# Altium project USB_HUB.PrjPcb
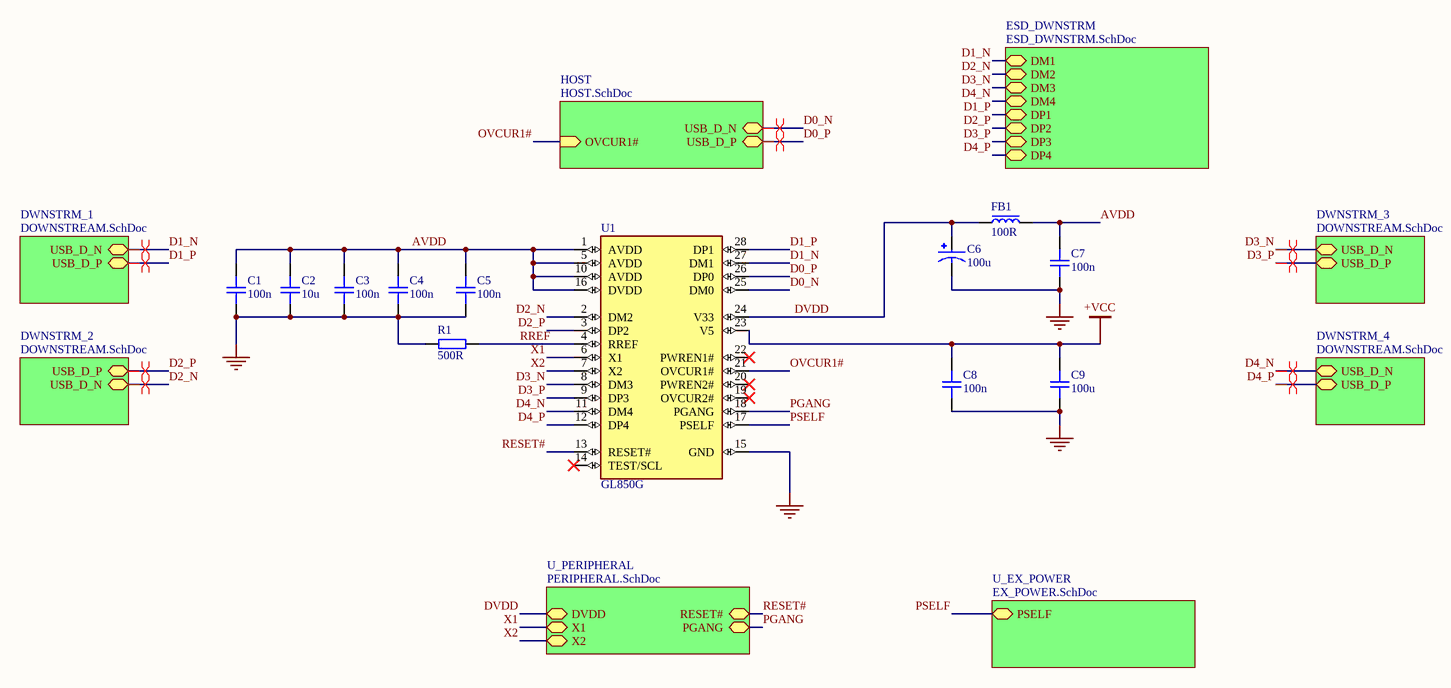
[diagram p0: MAIN.SchDoc]
5 sheets, 51 parts. Net scope: hierarchical (ports join the sheet entries above them; power ports are global).
Board file: USB_HUB.PcbDoc
Sheets:
  MAIN.SchDoc
    DWNSTRM_1 = DOWNSTREAM.SchDoc
    DWNSTRM_2 = DOWNSTREAM.SchDoc
    DWNSTRM_3 = DOWNSTREAM.SchDoc
    DWNSTRM_4 = DOWNSTREAM.SchDoc
    ESD_DWNSTRM = ESD_DWNSTRM.SchDoc
    U_PERIPHERAL = PERIPHERAL.SchDoc
    U_EX_POWER = EX_POWER.SchDoc

## Sheet MAIN.SchDoc
size A3; SheetNumber: 1; SheetTotal: 6

### Parts
C1  100n  [CAP_0805]
C2  10u  [CAP_0805]
C3  100n  [CAP_0805]
C4  100n  [CAP_0805]
C5  100n  [CAP_0805]
C6  100u  [CAP_EEEHA0J101WR]
C7  100n  [CAP_0805]
C8  100n  [CAP_0805]
C9  100u  [CAP_0805]
FB1  100R  [FB_0603]
R1  500R  [RES_0603]
U1  GL850G  [SSOP28]

### Sub-sheets
DWNSTRM_1 = DOWNSTREAM.SchDoc: USB_D_N (bidir), USB_D_P (bidir)
DWNSTRM_2 = DOWNSTREAM.SchDoc: USB_D_N (bidir), USB_D_P (bidir)
DWNSTRM_3 = DOWNSTREAM.SchDoc: USB_D_N (bidir), USB_D_P (bidir)
DWNSTRM_4 = DOWNSTREAM.SchDoc: USB_D_N (bidir), USB_D_P (bidir)
ESD_DWNSTRM = ESD_DWNSTRM.SchDoc: DM1 (bidir), DM2 (bidir), DM3 (bidir), DM4 (bidir), DP1 (bidir), DP2 (bidir), DP3 (bidir), DP4 (bidir)
HOST = HOST.SchDoc (file not in this document): USB_D_N (bidir), USB_D_P (bidir), OVCUR1# (in)
U_EX_POWER = EX_POWER.SchDoc: PSELF (bidir)
U_PERIPHERAL = PERIPHERAL.SchDoc: RESET# (bidir), PGANG (bidir), DVDD (bidir), X1 (bidir), X2 (bidir)

### Nets
+VCC: C8.2 C9.2 U1.23(V5)
GND: C1.1 C2.1 C3.2 C4.1 C5.1 C6.2 C7.1 C8.1 C9.1 R1.1 U1.15(GND)
AVDD: C1.2 C2.2 C3.1 C4.2 C5.2 C7.2 FB1.2 U1.1(AVDD) U1.5(AVDD) U1.10(AVDD) U1.16(DVDD)
D0_N: U1.25(DM0) ; sheet HOST/USB_D_N
D0_P: U1.26(DP0) ; sheet HOST/USB_D_P
D1_N: U1.27(DM1) ; sheet DWNSTRM_1/USB_D_N, sheet ESD_DWNSTRM/DM1
D1_P: U1.28(DP1) ; sheet DWNSTRM_1/USB_D_P, sheet ESD_DWNSTRM/DP1
D2_N: U1.2(DM2) ; sheet DWNSTRM_2/USB_D_N, sheet ESD_DWNSTRM/DM2
D2_P: U1.3(DP2) ; sheet DWNSTRM_2/USB_D_P, sheet ESD_DWNSTRM/DP2
D3_N: U1.8(DM3) ; sheet DWNSTRM_3/USB_D_N, sheet ESD_DWNSTRM/DM3
D3_P: U1.9(DP3) ; sheet DWNSTRM_3/USB_D_P, sheet ESD_DWNSTRM/DP3
D4_N: U1.11(DM4) ; sheet DWNSTRM_4/USB_D_N, sheet ESD_DWNSTRM/DM4
D4_P: U1.12(DP4) ; sheet DWNSTRM_4/USB_D_P, sheet ESD_DWNSTRM/DP4
DVDD: C6.1 FB1.1 U1.24(V33) ; sheet U_PERIPHERAL/DVDD
OVCUR1#: U1.21(OVCUR1#) ; sheet HOST/OVCUR1#
PGANG: U1.18(PGANG) ; sheet U_PERIPHERAL/PGANG
PSELF: U1.17(PSELF) ; sheet U_EX_POWER/PSELF
RESET#: U1.13(RESET#) ; sheet U_PERIPHERAL/RESET#
RREF: R1.2 U1.4(RREF)
X1: U1.6(X1) ; sheet U_PERIPHERAL/X1
X2: U1.7(X2) ; sheet U_PERIPHERAL/X2

Not connected (* = marked no-connect by the designer): U1 14(TEST/SCL)* 19(OVCUR2#)* 20(PWREN2#)* 22(PWREN1#)*

### Layout directives
differential pair: D0_N, D0_P, D1_N, D1_P, D2_N, D2_P, D3_N, D3_P, D4_N, D4_P

### Library data of the parts
C1-C5 C7-C9 = CAP_0805: Capacitor SMD 0805; Manufacturer: *; Manufacturer Part Number: *; Distributor Link: *; LCSC: *; Rating: *; Dielectric: *
C6 = EEEHA0J101WR: CAPACITOR ALUM ELEC, 100UF, 20%, 6.3V, S; CAPACITOR ALUM ELEC, 100UF, 20%, 6.3V, SMD; Product Range:PANASONIC - HA Series; Capacitance:100ÂµF; Capacitance Tolerance:Â± 20%; Voltage Rating:6.3V; Capacitor Case Style:Radial Can - SMD; Diameter:5mm; Height:5.4mm; Series:HA; MF: Panasonic Electronic; MP: EEE-HA0J101WR; Availability: In Stock; Check_prices: https://www.snapeda.com/parts/EEE-HA0J101WR/Panasonic%20Electronic%20Components/view-part/2733110/?ref=eda; SnapEDA_Link: https://www.snapeda.com/parts/EEE-HA0J101WR/Panasonic%20Electronic%20Components/view-part/2733110/?ref=snap; Purchase-URL: https://pricing.snapeda.com/search/part/EEE-HA0J101WR/?ref=eda; Package: RADIAL-2 Panasonic; Value: *; Price: None
FB1 = FB_0603: Ferrite Bead SMD 0603; Manufacturer: *; Manufacturer Part Number: *; Distributor Link: *; LCSC: *
R1 = RES_0603: Resistor SMD 0603; Manufacturer: *; Manufacturer Part Number: *; Distributor Link: *; LCSC: *
U1 = GL850G: Programmable Logic IC Development Tools; Manufacturer: Vishay Intertechnology; SnapEDA_Link: https://www.snapeda.com/parts/GL850G/Vishay/view-part/?ref=snap; Availability: Not in stock; Check_prices: https://www.snapeda.com/parts/GL850G/Vishay/view-part/?ref=eda; Manufacturer Part Number: GL850G; Package: None; Price: None

## Sheet DOWNSTREAM.SchDoc
size A4; SheetNumber: 3; SheetTotal: 6
Used 4 times, as channels DWNSTRM_1, DWNSTRM_2, DWNSTRM_3, DWNSTRM_4. Parts and nets are listed once, with the designators drawn on the sheet.
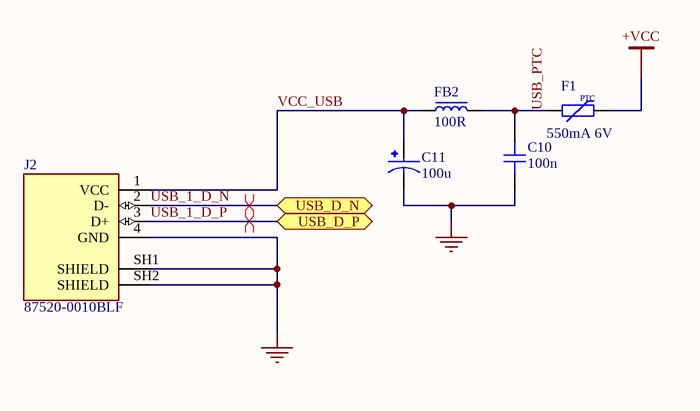
[diagram p1: DOWNSTREAM.SchDoc]

### Parts
C10  100n  [CAP_0805]
C11  100u  [CAP_EEEHA0J101WR]
F1  550mA 6V  [FUSE_1206]
FB2  100R  [FB_0603]
J2  87520-0010BLF  [AMPHENOL_87520-0010BLF]

### Ports
USB_D_N (bidir), USB_D_P (bidir)

### Nets
+VCC: F1.2
GND: C10.1 C11.2 J2.4(GND) J2.SH1(SHIELD) J2.SH2(SHIELD)
USB_1_D_N: J2.2(D-) ; port USB_D_N
USB_1_D_P: J2.3(D+) ; port USB_D_P
USB_PTC: C10.2 F1.1 FB2.2
VCC_USB: C11.1 FB2.1 J2.1(VCC)

### Channels
DWNSTRM_1: designators end in A; ports USB_D_N=D1_N USB_D_P=D1_P
DWNSTRM_2: designators end in B; ports USB_D_N=D2_N USB_D_P=D2_P
DWNSTRM_3: designators end in C; ports USB_D_N=D3_N USB_D_P=D3_P
DWNSTRM_4: designators end in D; ports USB_D_N=D4_N USB_D_P=D4_P

### Layout directives
differential pair: D1_N, D1_P

### Notes on the sheet
- (in symbol FUSE_PPTC_1206) PTC

### Library data of the parts
C10 = CAP_0805: Capacitor SMD 0805; Manufacturer: *; Manufacturer Part Number: *; Distributor Link: *; LCSC: *; Rating: *; Dielectric: *
C11 = EEEHA0J101WR: as C6 on sheet MAIN; Availability: In Stock; Check_prices: https://www.snapeda.com/parts/EEE-HA0J101WR/Panasonic%20Electronic%20Components/view-part/2733110/?ref=eda; SnapEDA_Link: https://www.snapeda.com/parts/EEE-HA0J101WR/Panasonic%20Electronic%20Components/view-part/2733110/?ref=snap; Purchase-URL: https://pricing.snapeda.com/search/part/EEE-HA0J101WR/?ref=eda; Package: RADIAL-2 Panasonic; Value: *; Price: None
F1 = FUSE_PPTC_1206: Fuse PPTC SMD 1206; Manufacturer: *; Manufacturer Part Number: *
FB2 = FB_0603: Ferrite Bead SMD 0603; Manufacturer: *; Manufacturer Part Number: *; Distributor Link: *; LCSC: *
J2 = 87520-0010BLF: Conn Data USB TypeA Socket 4Cnts RightAngle ThruHole White 1.57mmPCB | Amphenol FCI (Amphenol CS) 87520-0010BLF; MF: AMPHENOL ICC / FCI; SnapEDA_Link: https://www.snapeda.com/parts/87520-0010BLF/Amphenol/view-part/?ref=snap; Package: None; Value: *; MP: 87520-0010BLF; Check_prices: https://www.snapeda.com/parts/87520-0010BLF/Amphenol/view-part/?ref=eda

## Sheet ESD_DWNSTRM.SchDoc
size A4; SheetNumber: 4; SheetTotal: 6
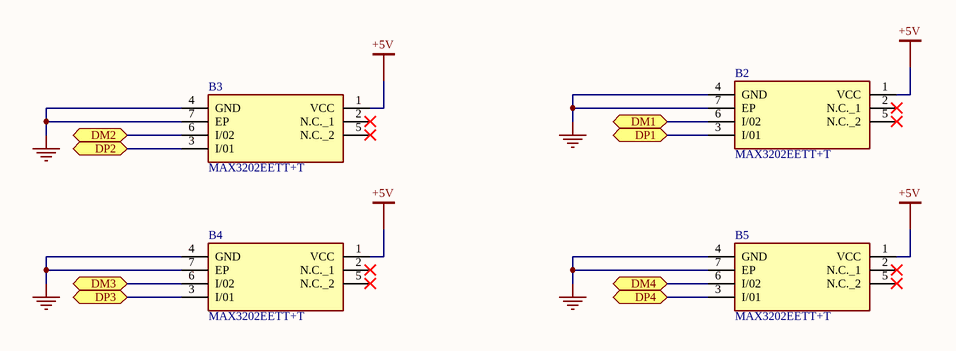
[diagram p2: ESD_DWNSTRM.SchDoc]

### Parts
B2  MAX3202EETT+T  [SON95P300X300X80-7N]
B3  MAX3202EETT+T  [SON95P300X300X80-7N]
B4  MAX3202EETT+T  [SON95P300X300X80-7N]
B5  MAX3202EETT+T  [SON95P300X300X80-7N]

### Ports
DM1 (bidir), DM2 (bidir), DM3 (bidir), DM4 (bidir), DP1 (bidir), DP2 (bidir), DP3 (bidir), DP4 (bidir)

### Nets
+5V: B2.1(VCC) B3.1(VCC) B4.1(VCC) B5.1(VCC)
GND: B2.4(GND) B2.7(EP) B3.4(GND) B3.7(EP) B4.4(GND) B4.7(EP) B5.4(GND) B5.7(EP)
D1_N: B2.6(I/02) ; port DM1
D1_P: B2.3(I/01) ; port DP1
D2_N: B3.6(I/02) ; port DM2
D2_P: B3.3(I/01) ; port DP2
D3_N: B4.6(I/02) ; port DM3
D3_P: B4.3(I/01) ; port DP3
D4_N: B5.6(I/02) ; port DM4
D4_P: B5.3(I/01) ; port DP4

Not connected (* = marked no-connect by the designer): B2 2(N.C._1)* 5(N.C._2)*; B3 2(N.C._1)* 5(N.C._2)*; B4 2(N.C._1)* 5(N.C._2)*; B5 2(N.C._1)* 5(N.C._2)*

### Library data of the parts
B2-B5 = MAX3202EETT+T: ESD Suppressors / TVS Diodes Low-Capacitance, 2/3/4/6-Channel, 15kV ESD-Protection Arrays for High-Speed Data Interfaces; Manufacturer_Name: Analog Devices; Geometry.Height: 0.8mm; Mouser Part Number: 700-MAX3202EETTT; Mouser Price/Stock: https://www.mouser.co.uk/ProductDetail/Analog-Devices-Maxim-Integrated/MAX3202EETT%2bT?qs=8wHch9UpSvZOsR663CaSvw%3D%3D; Manufacturer_Part_Number: MAX3202EETT+T; Datasheet Link: https://pdfserv.maximintegrated.com/en/ds/MAX3202E-MAX3206E.pdf

## Sheet PERIPHERAL.SchDoc
size A4; SheetNumber: 5; SheetTotal: 6
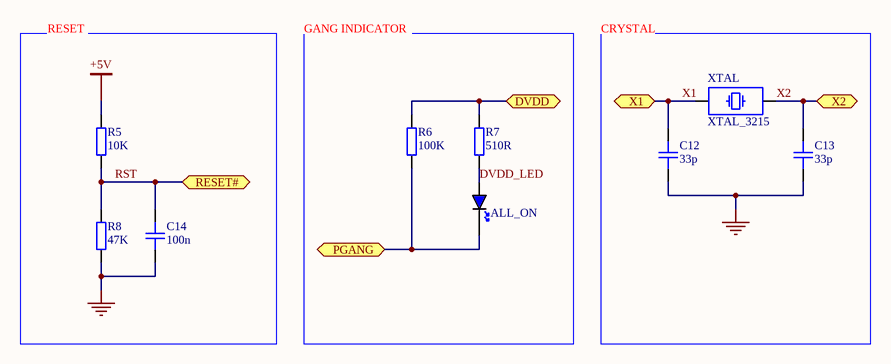
[diagram p3: PERIPHERAL.SchDoc]

### Parts
ALL_ON  BLUE  [LED_0603_BLUE]  (value not drawn)
C12  33p  [CAP_0402]
C13  33p  [CAP_0402]
C14  100n  [CAP_0805]
R5  10K  [RES_0805]
R6  100K  [RES_0603]
R7  510R  [RES_0603]
R8  47K  [RES_0603]
XTAL  XTAL_3215  [XTAL_3215-2]

### Ports
DVDD (bidir), PGANG (bidir), RESET# (bidir), X1 (bidir), X2 (bidir)

### Nets
+5V: R5.2
GND: C12.1 C13.1 C14.1 R8.1
DVDD: R6.2 R7.2 ; port DVDD
DVDD_LED: ALL_ON.A R7.1
PGANG: ALL_ON.K R6.1 ; port PGANG
RST: C14.2 R5.1 R8.2 ; port RESET#  [project net RESET#]
X1: C12.2 XTAL.1 ; port X1
X2: C13.2 XTAL.2 ; port X2

### Notes on the sheet
- RESET
- GANG INDICATOR
- CRYSTAL

### Library data of the parts
ALL_ON = LED_0603_BLUE: LED 0603 BLUE SMD
C12 C13 = CAP_0402: Capacitor SMD 0402; Manufacturer: *; Manufacturer Part Number: *; Distributor Link: *; LCSC: *; Rating: *; Dielectric: *
C14 = CAP_0805: Capacitor SMD 0805; Manufacturer: *; Manufacturer Part Number: *; Distributor Link: *; LCSC: *; Rating: *; Dielectric: *
R5 = RES_0805: Resistor SMD 0805; Manufacturer: *; Manufacturer Part Number: *; Distributor Link: *; LCSC: *
R6-R8 = RES_0603: Resistor SMD 0603; Manufacturer: *; Manufacturer Part Number: *; Distributor Link: *; LCSC: *
XTAL = XTAL_3215: Crystal SMD 3215; Distributor Link: *

## Sheet EX_POWER.SchDoc
size A4; SheetNumber: 6; SheetTotal: 6
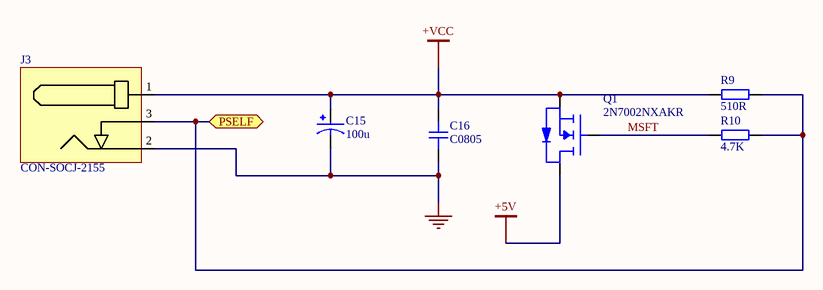
[diagram p4: EX_POWER.SchDoc]

### Parts
C15  100u  [CAP_EEEHA0J101WR]
C16  C0805  [CAP_0805]
J3  CON-SOCJ-2155  [CON-SOCJ-2155]
Q1  2N7002NXAKR  [SSM3J338R,LF-SOT23-F]
R9  510R  [RES_0603]
R10  4.7K  [RES_0603]

### Ports
PSELF (bidir)

### Nets
+5V: Q1.D
+VCC: C15.1 C16.2 J3.1 Q1.S R9.1
GND: C15.2 C16.1 J3.2
MSFT: Q1.G R10.1
PSELF: J3.3 R9.2 R10.2 ; port PSELF

### Library data of the parts
C15 = EEEHA0J101WR: as C6 on sheet MAIN; Availability: In Stock; Check_prices: https://www.snapeda.com/parts/EEE-HA0J101WR/Panasonic%20Electronic%20Components/view-part/2733110/?ref=eda; SnapEDA_Link: https://www.snapeda.com/parts/EEE-HA0J101WR/Panasonic%20Electronic%20Components/view-part/2733110/?ref=snap; Purchase-URL: https://pricing.snapeda.com/search/part/EEE-HA0J101WR/?ref=eda; Package: RADIAL-2 Panasonic; Value: *; Price: None
C16 = CAP_0805: Capacitor SMD 0805; Manufacturer: *; Manufacturer Part Number: *; Distributor Link: *; LCSC: *; Rating: *; Dielectric: *
J3 = CON-SOCJ-2155: DC Barrell Jack 2.1mm 30V 2.5A THT; Manufacturer: Gravitech; Manufacturer Part Number: CON-SOCJ-2155
Q1 = 2N7002NXAKR: MOSFET N-Channel Vds=60V Id=300mA with ESD Protection; Manufacturer: Nexperia; Manufacturer Part Number: 2N7002NXAKR
R9 R10 = RES_0603: Resistor SMD 0603; Manufacturer: *; Manufacturer Part Number: *; Distributor Link: *; LCSC: *

## Nets that join several sheets
+5V: ESD_DWNSTRM (B2.1 B3.1 B4.1 B5.1), PERIPHERAL (R5.2), EX_POWER (Q1.D)
+VCC: MAIN (C8.2 C9.2 U1.23), DWNSTRM_1 (F1A.2), DWNSTRM_2 (F1B.2), DWNSTRM_3 (F1C.2), DWNSTRM_4 (F1D.2), EX_POWER (5 pins)
GND: MAIN (11 pins), DWNSTRM_1 (5 pins), DWNSTRM_2 (5 pins), DWNSTRM_3 (5 pins), DWNSTRM_4 (5 pins), ESD_DWNSTRM (8 pins), PERIPHERAL (C12.1 C13.1 C14.1 R8.1), EX_POWER (C15.2 C16.1 J3.2)
D1_N: MAIN (U1.27), DWNSTRM_1 (J2A.2), ESD_DWNSTRM (B2.6)
D1_P: MAIN (U1.28), DWNSTRM_1 (J2A.3), ESD_DWNSTRM (B2.3)
D2_N: MAIN (U1.2), DWNSTRM_2 (J2B.2), ESD_DWNSTRM (B3.6)
D2_P: MAIN (U1.3), DWNSTRM_2 (J2B.3), ESD_DWNSTRM (B3.3)
D3_N: MAIN (U1.8), DWNSTRM_3 (J2C.2), ESD_DWNSTRM (B4.6)
D3_P: MAIN (U1.9), DWNSTRM_3 (J2C.3), ESD_DWNSTRM (B4.3)
D4_N: MAIN (U1.11), DWNSTRM_4 (J2D.2), ESD_DWNSTRM (B5.6)
D4_P: MAIN (U1.12), DWNSTRM_4 (J2D.3), ESD_DWNSTRM (B5.3)
DVDD: MAIN (C6.1 FB1.1 U1.24), PERIPHERAL (R6.2 R7.2)
PGANG: MAIN (U1.18), PERIPHERAL (ALL_ON.K R6.1)
PSELF: MAIN (U1.17), EX_POWER (J3.3 R9.2 R10.2)
RESET#: MAIN (U1.13), PERIPHERAL (C14.2 R5.1 R8.2)
X1: MAIN (U1.6), PERIPHERAL (C12.2 XTAL.1)
X2: MAIN (U1.7), PERIPHERAL (C13.2 XTAL.2)